# EAGLE design X8-Navboard (EAGLE 7.5.0)
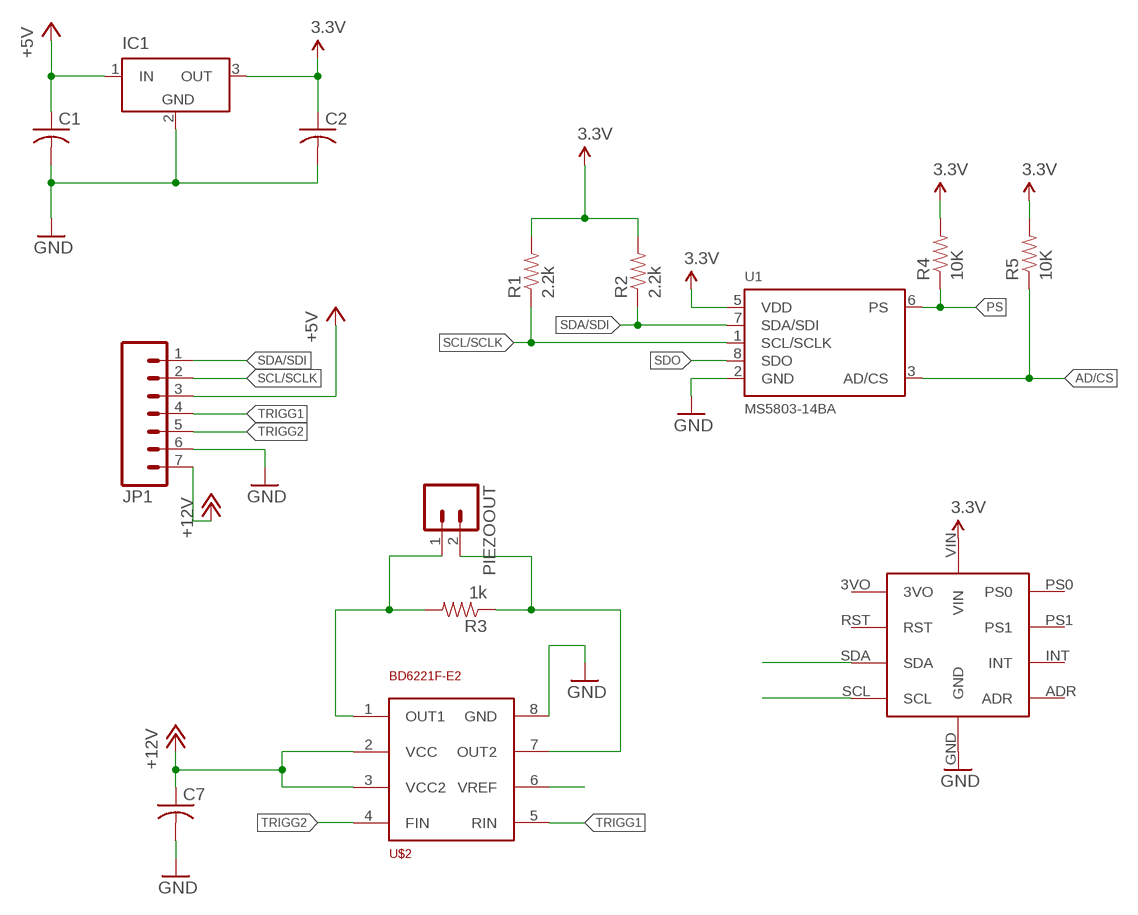
[diagram p0: schematic, sheet 1]

## Parts
C1  C-USC0603  [C0603]
C2  C-USC0603  [C0603]
C7  C-USC0603  [C0603]
IC1  LT1129CST5  [SOT223]
JP1  M07  [1X07]
PIEZOOUT  M02LOCK_LONGPADS  [1X02_LOCK_LONGPADS]
R1  2.2k  2.2KOHM1/10W1%(0603)  [0603-RES]
R2  2.2k  2.2KOHM1/10W1%(0603)  [0603-RES]
R3  1k  2.2KOHM1/10W1%(0603)  [0603-RES]
R4  10K  10KOHM1/10W1%(0603)0603  [0603-RES]
R5  10K  10KOHM1/10W1%(0603)0603  [0603-RES]
U1  MS5803-14BA  [MS5803]
U$1  BNO055_9DOF_BREAKOUT  [BNO055]
U$2  BD6221F-E2  [SOIC8]

## Nets
3.3V: C2.1 IC1.3(OUT) R1.2 R2.2 R4.2 R5.2 U1.5(VDD) U$1.VIN
+5V: C1.1 IC1.1(IN) JP1.3
+12V: C7.1 JP1.7 U$2.2(VCC) U$2.3(VCC2)
AD/CS: R5.1 U1.3(AD/CS)
GND: C1.2 C2.2 C7.2 IC1.2(GND) JP1.6 U1.2(GND) U$1.GND U$2.8(GND)
N$1: PIEZOOUT.1 R3.2 U$2.1(OUT1)
N$2: PIEZOOUT.2 R3.1 U$2.7(OUT2)
N$9: U$2.6(VREF)
PS: R4.1 U1.6(PS)
SCL/SCLK: JP1.2 R1.1 U1.1(SCL/SCLK) U$1.SCL
SDA/SDI: JP1.1 R2.1 U1.7(SDA/SDI) U$1.SDA
SDO: U1.8(SDO)
TRIGG1: JP1.4 U$2.5(RIN)
TRIGG2: JP1.5 U$2.4(FIN)
Unconnected: U$1.3VO U$1.ADR U$1.INT U$1.PS0 U$1.PS1 U$1.RST

## Power pins joined to a net without a drawn wire
GND: IC1.4(GND)

## Library data of the parts
C1 C2 C7 = resistor:C-US: CAPACITOR, American symbol
IC1 = linear-technology:LT1129CST5: VOLTAGE REGULATOR with shutdown; MPN: LT1129CST-5#PBF; OC_FARNELL: 1663375; OC_NEWARK: 57M2069
JP1 = SparkFun-Connectors:M07: Header 7 Standard 7-pin 0.1" header. Use with straight break away headers (SKU : PRT-00116), right angle break away headers (PRT-00553), swiss pins (PRT-00743), machine pins (PRT-00117), and female headers (PRT-00115). NOTES ON THE VARIANTS LOCK and LOCK_LONGPADS... This footprint was designed to help hold the alignment of a through-hole component (i.e. 7-pin header) while soldering it into place. You may notice that each hole has been shifted either up or down by 0.005 of an inch from it's more standard position (which is usually a perfectly straight line). This slight alteration caused the pins (the squares in the middle) to touch the edges of the holes. Because they are alternating, it causes a "brace" to hold the header in place. 0.005 has proven to be the perfect amount of "off-center" position when using our standard breakaway headers. Although looks a little odd when you look at the bare footprint, once you have a header in there, the alteration is very hard to notice. Also, if you push a header all the way into place, it is covered up entirely on the bottom side. This idea of altering the position of holes to aid alignment will be further integrated into the Sparkfun Library for other footprints. It can help hold any component with 3 or more connection pins.
PIEZOOUT = SparkFun-Connectors:M02: Standard 2-pin 0.1" header. Use with - straight break away headers ( PRT-00116) - right angle break away headers (PRT-00553) - swiss pins (PRT-00743) - machine pins (PRT-00117) - female headers (PRT-00115) Molex polarized connector foot print use with: PRT-08233 with associated crimp pins and housings. 2.54_SCREWTERM for use with PRT-10571. 3.5mm Screw Terminal footprints for PRT-08084 5mm Screw Terminal footprints for use with PRT-08432
R1 R2 = SparkFun-Resistors:2.2KOHM1/10W1%(0603): RES-08272; PROD_ID: RES-08272
R3 = SparkFun-Resistors:2.2KOHM1/10W1%(0603): RES-08272; PROD_ID: RES-08272; VALUE: 2.2k
R4 R5 = SparkFun-Resistors:10KOHM1/10W1%(0603): RES-00824; PROD_ID: RES-00824
U1 = MS5803:MS5803-14BA; PROD_ID: IC-12111
U$1 = Other:BNO055_9DOF_BREAKOUT
U$2 = BNo-055:BD6221F-E2: IC MOTOR DRIVER Half Bridge

## Board
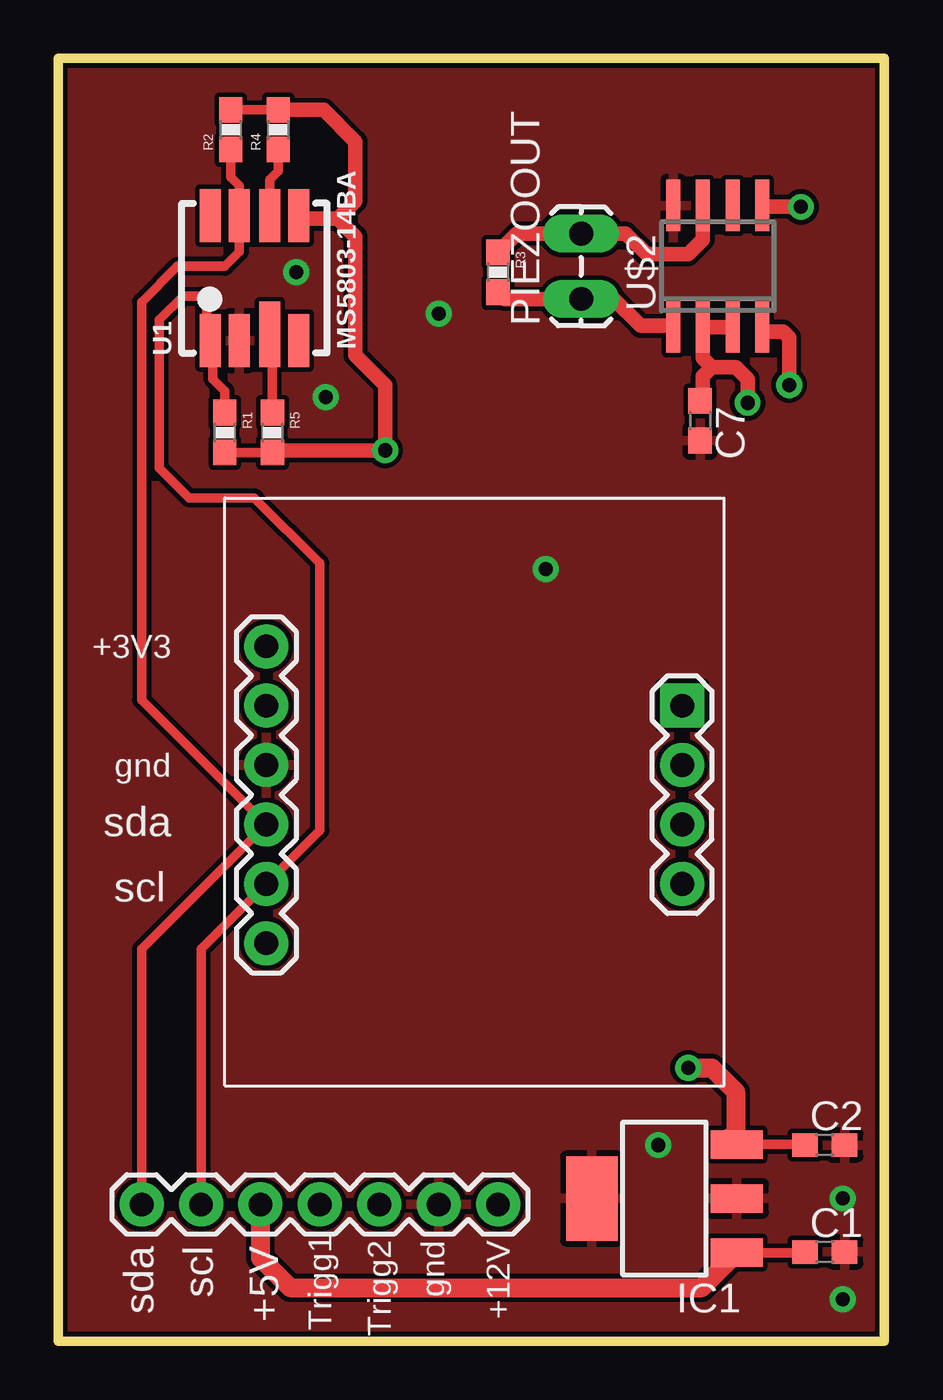
[diagram p1: board, top side]
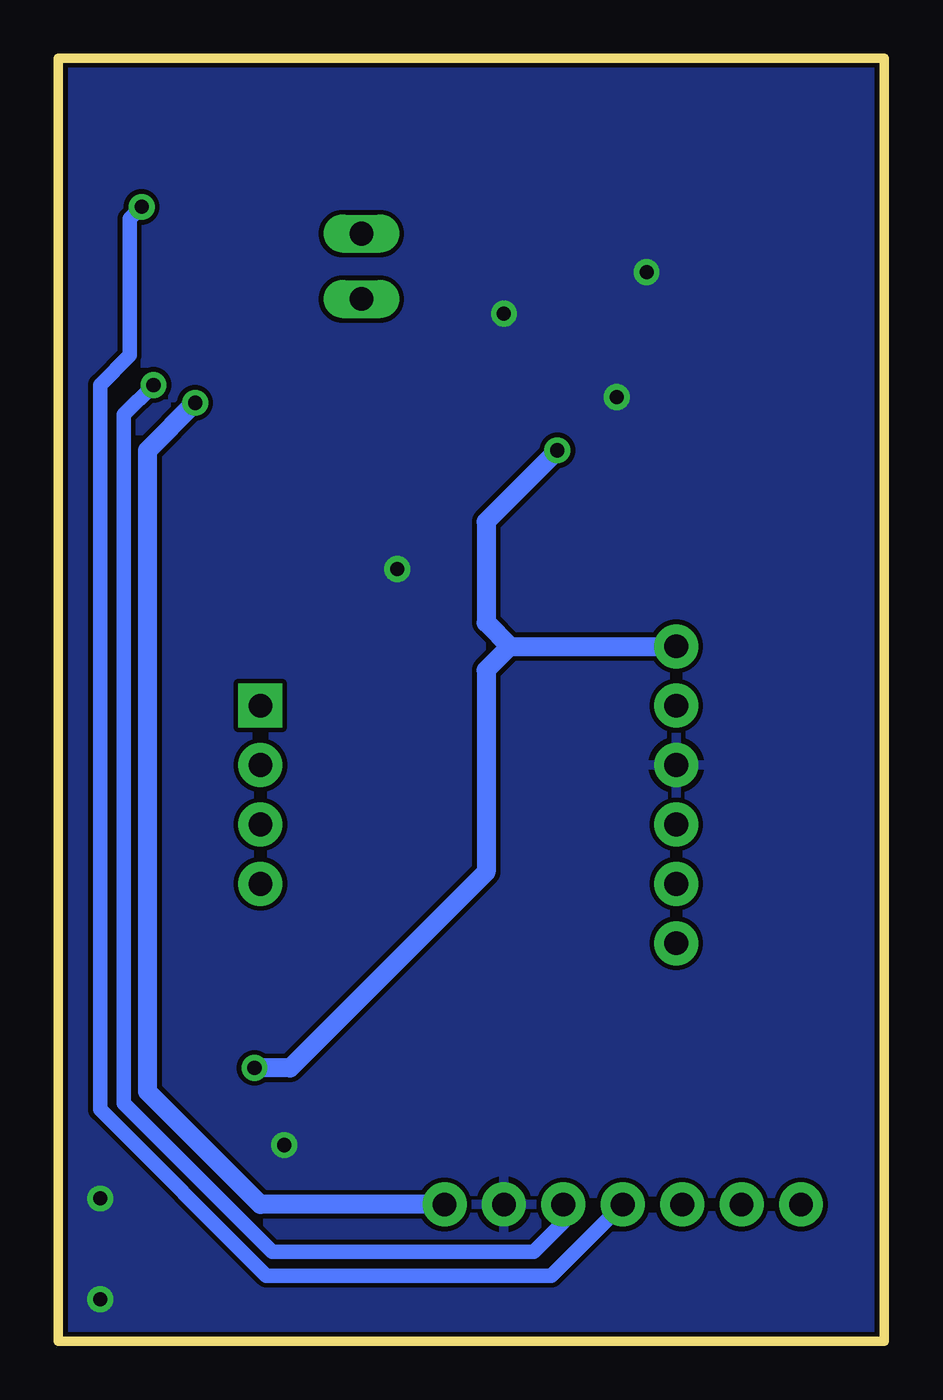
[diagram p2: board, bottom side, seen from below]

Size 35.31 x 54.86 mm. Coordinates in mm from the lower left corner, seen from the top.
Outline: 0,0 0,54.86 35.31,54.86 35.31,0 0,0
Copper layers (1*16): Top 0.035mm / dielectric 1.5mm / Bottom 0.035mm
Design rules "SparkFun-2-layer": minimum track width 7mil, minimum drill 15mil, track to track 8mil, track to pad 8mil, pad to pad 8mil, via to via 8mil, smd to smd 8mil, copper to edge 8mil, drill to drill 8mil, minimum pad ring 12mil, minimum via ring 10mil, stop-mask expansion 4mil, vias tented up to drill 20mil, thermal gap 10mil

### Footprints (pad centres in the part's own frame; a part is rotated, then mirrored left to right if it is on the bottom)
C0603 = smd 1.1 x 1: 1 -0.85,0; 2 0.85,0
SOT223 = smd 1.219 x 2.235: 1 -2.311,-3.099; 2 0,-3.099; 3 2.311,-3.099 | smd 3.6 x 2.2: 4 0,3.099
1X07 = drill 1.016 pad 1.88: 1 0,0; 2 2.54,0; 3 5.08,0; 4 7.62,0; 5 10.16,0; 6 12.7,0; 7 15.24,0
1X02_LOCK_LONGPADS = drill 1.016 long: 1 -0.127,0; 2 2.667,0
0603-RES = smd 1.1 x 1: 1 -0.85,0; 2 0.85,0
MS5803 = smd 2.25 x 0.9: 1 -2.675,1.9; 2 -2.675,0.65; 4 -2.675,-1.9; 5 2.675,-1.9; 6 2.675,-0.65; 7 2.675,0.65; 8 2.675,1.9 | smd 2.8 x 0.9: 3 -2.4,-0.65
BNO055 = drill 1.016 pad 1.88: 3VO -8.89,2.54; ADR 8.89,-5.08; GND -8.89,0; INT 8.89,-2.54; PS1 8.89,0; RST -8.89,-7.62; SCL -8.89,-5.08; SDA -8.89,-2.54; VIN -8.89,5.08 | drill 1.016 pad 1.88 square: PS0 8.89,2.54
SOIC8 = smd 0.6 x 2.2: 1 -1.905,-2.6; 2 -0.635,-2.6; 3 0.635,-2.6; 4 1.905,-2.6; 5 1.905,2.6; 6 0.635,2.6; 7 -0.635,2.6; 8 -1.905,2.6

### Placement (x,y rotation side)
C1  32.77,3.81 0 top
C2  32.77,8.38 0 top
C7  27.43,39.37 270 top
IC1  25.91,6.1 90 top
JP1  3.56,5.84 0 top
PIEZOOUT  22.35,44.7 90 top
R1  7.11,38.86 270 top
R2  7.37,51.82 90 top
R3  18.8,45.72 270 top
R4  9.4,51.82 90 top
R5  9.14,38.86 270 top
U1  8.38,45.47 90 top
U$1  17.78,24.64 0 top
U$2  28.19,45.97 0 top

### Tracks (layer width: path | path; a pad name or v marks a point on that pad's centre or on a via)
3.3V  (via drill 0.6)
  Top 0.406: R1.2 R5.2 | R2.2 R4.2 | IC1.3 31.89,8.41 C2.1
  Top 0.61: R5.2 9.23,38.1 v13.97,38.1 13.97,40.89 12.7,42.16 12.7,47.24 11.94,48.01 | R4.2 11.34,52.67 12.7,51.31 12.7,48.77 11.94,48.01 | U1.5 10.42,48.01 11.94,48.01
  Top 0.813: 28.7,8.71 IC1.3 | 28.96,8.53 arc45 IC1.3 | v26.92,11.68 27.94,11.68 28.96,10.67 28.96,8.46 IC1.3
  Bottom 0.813: 16,29.72 17.02,30.73 17.02,35.05 v13.97,38.1 | 16,29.72 17.02,28.7 17.02,20.07 25.4,11.68 v26.92,11.68 | 16,29.72 U$1.VIN
+5V
  Top 0.406: IC1.1 31.89,3.79 C1.1
  Top 0.813: JP1.3 8.64,3.56 9.91,2.29 27.51,2.29 IC1.1
+12V  (via drill 0.6)
  Top 0.61: U$2.3 U$2.2 27.56,42.04 27.94,41.66 | C7.1 27.56,40.35 27.56,41.27 27.94,41.66 | v29.46,40.13 29.46,41.15 28.96,41.66 27.94,41.66
  Bottom 0.813: JP1.7 26.67,5.84 31.5,10.67 31.5,38.1 v29.46,40.13
AD/CS
  Top 0.406: R5.1 9.14,43.07 U1.3
GND  (via drill 0.6)
  other vias: 10.16,45.72 16.26,43.94 20.83,33.02 33.53,1.78 33.53,6.1 25.65,8.38 11.43,40.39
  pour Top: 0,54.86 35.31,54.86 35.31,0 0,0
  pour Bottom: 0,54.86 35.31,54.86 35.31,0 0,0
N$1
  Top 0.61: R3.2 19.09,44.58 PIEZOOUT.1 23.75,44.58 24.89,43.43 26.23,43.43 U$2.1
N$2
  Top 0.61: R3.1 19.6,47.37 PIEZOOUT.2 24.26,47.37 25.15,46.48 26.92,46.48 27.56,47.12 U$2.7
PS
  Top 0.406: U1.6 9.03,49.67 9.4,50.04 R4.1
SCL/SCLK
  Top 0.406: R1.1 7.11,40.64 6.6,41.15 6.6,42.67 U1.1 6.35,42.92 6.35,44.45 6.1,44.7 5.33,44.7 4.32,43.69 4.32,37.34 5.59,36.07 8.38,36.07 11.18,33.27 11.18,21.84 U$1.SCL 6.1,16.76 JP1.2
SDA/SDI
  Top 0.406: R2.1 7.37,49.78 7.73,49.42 U1.7 7.73,46.59 7.11,45.97 5.08,45.97 3.56,44.45 3.56,27.43 U$1.SDA 3.56,16.76 JP1.1
TRIGG1  (via drill 0.6)
  Top 0.61: v31.75,48.51 30.16,48.51 U$2.5
  Bottom 0.61: JP1.4 14.22,2.79 26.42,2.79 33.53,9.91 33.53,40.89 32.26,42.16 32.26,48.01 v31.75,48.51
TRIGG2  (via drill 0.6)
  Top 0.61: v31.24,40.89 31.24,42.93 30.99,43.18 30.29,43.18 U$2.4
  Bottom 0.61: JP1.5 13.72,5.08 14.99,3.81 26.16,3.81 32.51,10.16 32.51,39.62 v31.24,40.89

### Text on the board
tPlace: +3V3 | gnd | sda | scl | Trigg1 | sda | scl | +5V | Trigg2 | gnd | +12V